# Altium schematic sheet STM32F103ZGT6核心板.SchDoc
size A4
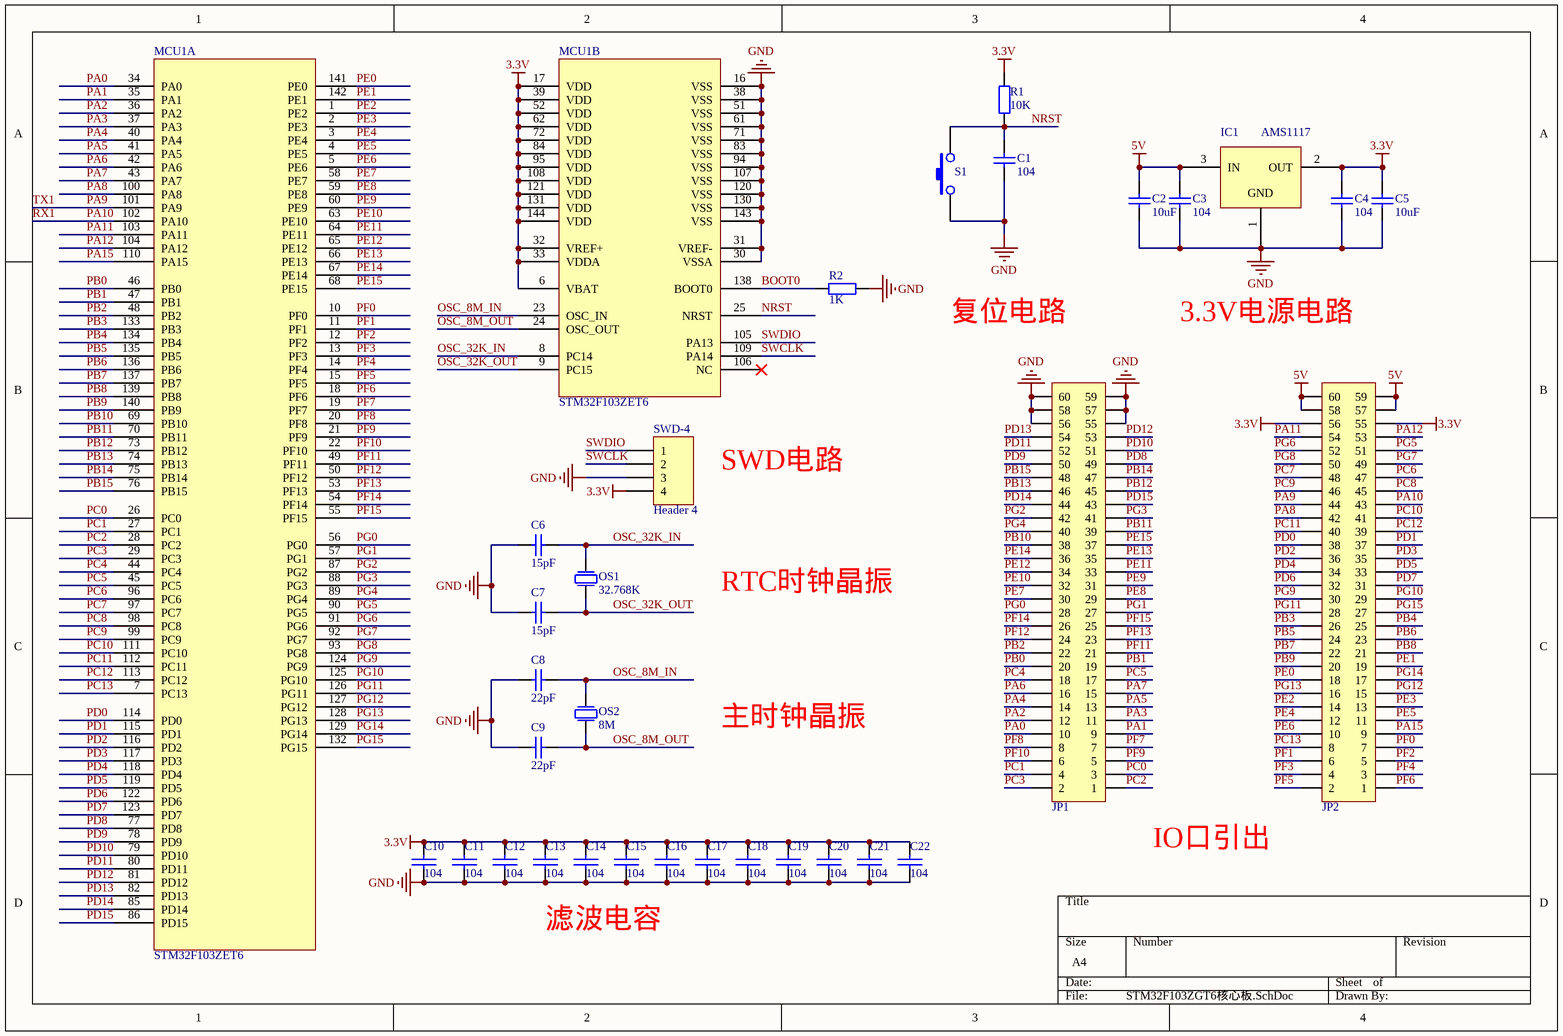
[diagram p0: STM32F103ZGT6核心板.SchDoc]

## Parts
C1  104  [C 0603_L]
C2  10uF  [C 0603_L]
C3  104  [C 0603_L]
C4  104  [C 0603_L]
C5  10uF  [C 0603_L]
C6  15pF  [C 0603_L]
C7  15pF  [C 0603_L]
C8  22pF  [C 0603_L]
C9  22pF  [C 0603_L]
C10  104  [C 0603_L]
C11  104  [C 0603_L]
C12  104  [C 0603_L]
C13  104  [C 0603_L]
C14  104  [C 0603_L]
C15  104  [C 0603_L]
C16  104  [C 0603_L]
C17  104  [C 0603_L]
C18  104  [C 0603_L]
C19  104  [C 0603_L]
C20  104  [C 0603_L]
C21  104  [C 0603_L]
C22  104  [C 0603_L]
IC1  AMS1117  [SOT89]
JP1  Header 2X30  [HDR-SMD_60P-P1.27-V-M-R2-C30-LS5.8]  (value not drawn)
JP2  Header 2X30  [HDR-SMD_60P-P1.27-V-M-R2-C30-LS5.8]  (value not drawn)
MCU1  STM32F103ZET6  [F-QFP20x20-G144/Z24N]  (parts A,B of 2)
OS1  32.768K  [R 0805_M]
OS2  8M  [OSC 5032-2P]
R1  10K  [R 0603_L]
R2  1K  [R 0603_L]
S1  KEY  [SWT3*4]  (value not drawn)
SWD-4  Header 4  [HDR1X4]

## Nets
3.3V: C4.2 C5.2 C10.1 C11.1 C12.1 C13.1 C14.1 C15.1 C16.1 C17.1 C18.1 C19.1 C20.1 C21.1 C22.1 IC1.2(OUT) JP2.55 JP2.56 MCU1.6(VBAT) MCU1.17(VDD) MCU1.32(VREF+) MCU1.33(VDDA) MCU1.39(VDD) MCU1.52(VDD) MCU1.62(VDD) MCU1.72(VDD) MCU1.84(VDD) MCU1.95(VDD) MCU1.108(VDD) MCU1.121(VDD) MCU1.131(VDD) MCU1.144(VDD) R1.2 SWD-4.4
5V: C2.2 C3.2 IC1.3(IN) JP2.57 JP2.58 JP2.59 JP2.60
GND: C1.1 C2.1 C3.1 C4.1 C5.1 C6.2 C7.2 C8.2 C9.2 C10.2 C11.2 C12.2 C13.2 C14.2 C15.2 C16.2 C17.2 C18.2 C19.2 C20.2 C21.2 C22.2 IC1.1(GND) JP1.55 JP1.56 JP1.57 JP1.58 JP1.59 JP1.60 MCU1.16(VSS) MCU1.30(VSSA) MCU1.31(VREF-) MCU1.38(VSS) MCU1.51(VSS) MCU1.61(VSS) MCU1.71(VSS) MCU1.83(VSS) MCU1.94(VSS) MCU1.107(VSS) MCU1.120(VSS) MCU1.130(VSS) MCU1.143(VSS) R2.1 S1.1 SWD-4.3
BOOT0: MCU1.138(BOOT0) R2.2
NRST: C1.2 MCU1.25(NRST) R1.1 S1.2
OSC_8M_IN: C8.1 MCU1.23(OSC_IN) OS2.1(P1)
OSC_8M_OUT: C9.1 MCU1.24(OSC_OUT) OS2.2(P2)
OSC_32K_IN: C6.1 MCU1.8(PC14) OS1.1(P1)
OSC_32K_OUT: C7.1 MCU1.9(PC15) OS1.2(P2)
PA0: JP1.10 MCU1.34(PA0)
PA1: JP1.9 MCU1.35(PA1)
PA2: JP1.12 MCU1.36(PA2)
PA3: JP1.11 MCU1.37(PA3)
PA4: JP1.14 MCU1.40(PA4)
PA5: JP1.13 MCU1.41(PA5)
PA6: JP1.16 MCU1.42(PA6)
PA7: JP1.15 MCU1.43(PA7)
PA8: JP2.42 MCU1.100(PA8)
PA9: JP2.44 MCU1.101(PA9)  [also labelled TX1]
PA10: JP2.43 MCU1.102(PA10)  [also labelled RX1]
PA11: JP2.54 MCU1.103(PA11)
PA12: JP2.53 MCU1.104(PA12)
PA15: JP2.9 MCU1.110(PA15)
PB0: JP1.20 MCU1.46(PB0)
PB1: JP1.19 MCU1.47(PB1)
PB2: JP1.22 MCU1.48(PB2)
PB3: JP2.26 MCU1.133(PB3)
PB4: JP2.25 MCU1.134(PB4)
PB5: JP2.24 MCU1.135(PB5)
PB6: JP2.23 MCU1.136(PB6)
PB7: JP2.22 MCU1.137(PB7)
PB8: JP2.21 MCU1.139(PB8)
PB9: JP2.20 MCU1.140(PB9)
PB10: JP1.38 MCU1.69(PB10)
PB11: JP1.39 MCU1.70(PB11)
PB12: JP1.45 MCU1.73(PB12)
PB13: JP1.46 MCU1.74(PB13)
PB14: JP1.47 MCU1.75(PB14)
PB15: JP1.48 MCU1.76(PB15)
PC0: JP1.3 MCU1.26(PC0)
PC1: JP1.4 MCU1.27(PC1)
PC2: JP1.1 MCU1.28(PC2)
PC3: JP1.2 MCU1.29(PC3)
PC4: JP1.18 MCU1.44(PC4)
PC5: JP1.17 MCU1.45(PC5)
PC6: JP2.47 MCU1.96(PC6)
PC7: JP2.48 MCU1.97(PC7)
PC8: JP2.45 MCU1.98(PC8)
PC9: JP2.46 MCU1.99(PC9)
PC10: JP2.41 MCU1.111(PC10)
PC11: JP2.40 MCU1.112(PC11)
PC12: JP2.39 MCU1.113(PC12)
PC13: JP2.8 MCU1.7(PC13)
PD0: JP2.38 MCU1.114(PD0)
PD1: JP2.37 MCU1.115(PD1)
PD2: JP2.36 MCU1.116(PD2)
PD3: JP2.35 MCU1.117(PD3)
PD4: JP2.34 MCU1.118(PD4)
PD5: JP2.33 MCU1.119(PD5)
PD6: JP2.32 MCU1.122(PD6)
PD7: JP2.31 MCU1.123(PD7)
PD8: JP1.49 MCU1.77(PD8)
PD9: JP1.50 MCU1.78(PD9)
PD10: JP1.51 MCU1.79(PD10)
PD11: JP1.52 MCU1.80(PD11)
PD12: JP1.53 MCU1.81(PD12)
PD13: JP1.54 MCU1.82(PD13)
PD14: JP1.44 MCU1.85(PD14)
PD15: JP1.43 MCU1.86(PD15)
PE0: JP2.18 MCU1.141(PE0)
PE1: JP2.19 MCU1.142(PE1)
PE2: JP2.14 MCU1.1(PE2)
PE3: JP2.13 MCU1.2(PE3)
PE4: JP2.12 MCU1.3(PE4)
PE5: JP2.11 MCU1.4(PE5)
PE6: JP2.10 MCU1.5(PE6)
PE7: JP1.30 MCU1.58(PE7)
PE8: JP1.29 MCU1.59(PE8)
PE9: JP1.31 MCU1.60(PE9)
PE10: JP1.32 MCU1.63(PE10)
PE11: JP1.33 MCU1.64(PE11)
PE12: JP1.34 MCU1.65(PE12)
PE13: JP1.35 MCU1.66(PE13)
PE14: JP1.36 MCU1.67(PE14)
PE15: JP1.37 MCU1.68(PE15)
PF0: JP2.7 MCU1.10(PF0)
PF1: JP2.6 MCU1.11(PF1)
PF2: JP2.5 MCU1.12(PF2)
PF3: JP2.4 MCU1.13(PF3)
PF4: JP2.3 MCU1.14(PF4)
PF5: JP2.2 MCU1.15(PF5)
PF6: JP2.1 MCU1.18(PF6)
PF7: JP1.7 MCU1.19(PF7)
PF8: JP1.8 MCU1.20(PF8)
PF9: JP1.5 MCU1.21(PF9)
PF10: JP1.6 MCU1.22(PF10)
PF11: JP1.21 MCU1.49(PF11)
PF12: JP1.24 MCU1.50(PF12)
PF13: JP1.23 MCU1.53(PF13)
PF14: JP1.26 MCU1.54(PF14)
PF15: JP1.25 MCU1.55(PF15)
PG0: JP1.28 MCU1.56(PG0)
PG1: JP1.27 MCU1.57(PG1)
PG2: JP1.42 MCU1.87(PG2)
PG3: JP1.41 MCU1.88(PG3)
PG4: JP1.40 MCU1.89(PG4)
PG5: JP2.51 MCU1.90(PG5)
PG6: JP2.52 MCU1.91(PG6)
PG7: JP2.49 MCU1.92(PG7)
PG8: JP2.50 MCU1.93(PG8)
PG9: JP2.30 MCU1.124(PG9)
PG10: JP2.29 MCU1.125(PG10)
PG11: JP2.28 MCU1.126(PG11)
PG12: JP2.15 MCU1.127(PG12)
PG13: JP2.16 MCU1.128(PG13)
PG14: JP2.17 MCU1.129(PG14)
PG15: JP2.27 MCU1.132(PG15)
SWCLK: MCU1.109(PA14) SWD-4.2
SWDIO: MCU1.105(PA13) SWD-4.1

Not connected (* = marked no-connect by the designer): MCU1 106(NC)*

## Notes on the sheet
- 复位电路
- 3.3V电源电路
- SWD电路
- RTC时钟晶振
- 主时钟晶振
- IO口引出
- 滤波电容

## Library data of the parts
C1-C9 = Cap1
  C1 C3 C4: value: 104
  C2 C5: value: 10uF
  C6 C7: value: 15pF
  C8 C9: value: 22pF
C10-C22 = CAP: Capacitor
IC1 = CJA1117
JP1 JP2 = Header 30X2: 30*2P接插件; BOM名称: 20*2P接插件; 版权归属: 封装库来自淘宝 ID：黄晶宝石; 学习资源: https://shop463601444.taobao.com
OS1 OS2 = 晶振
  OS1: vaule: 32.768K
  OS2: vaule: 8M
R1 R2 = Res
  R1: value: 10K
  R2: value: 1K
SWD-4 = Header 4: Header, 4-Pin; LatestRevisionDate: 17-Jul-2002; LatestRevisionNote: Re-released for DXP Platform.; Publisher: Altium Limited